# EAGLE design GPIO_duplication_board (EAGLE 7.3.0)
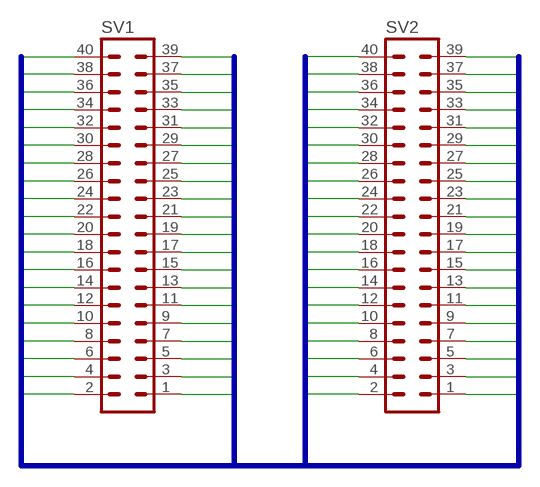
[diagram p0: schematic, sheet 1]

## Parts
SV1  MA20-2  [MA20-2]
SV2  MA20-2  [MA20-2]

## Nets
B1: SV1.1 SV2.1
B2: SV1.2 SV2.2
B3: SV1.3 SV2.3
B4: SV1.4 SV2.4
B5: SV1.5 SV2.5
B6: SV1.6 SV2.6
B7: SV1.7 SV2.7
B8: SV1.8 SV2.8
B9: SV1.9 SV2.9
B10: SV1.10 SV2.10
B11: SV1.11 SV2.11
B12: SV1.12 SV2.12
B13: SV1.13 SV2.13
B14: SV1.14 SV2.14
B15: SV1.15 SV2.15
B16: SV1.16 SV2.16
B17: SV1.17 SV2.17
B18: SV1.18 SV2.18
B19: SV1.19 SV2.19
B20: SV1.20 SV2.20
B21: SV1.21 SV2.21
B22: SV1.22 SV2.22
B23: SV1.23 SV2.23
B24: SV1.24 SV2.24
B25: SV1.25 SV2.25
B26: SV1.26 SV2.26
B27: SV1.27 SV2.27
B28: SV1.28 SV2.28
B29: SV1.29 SV2.29
B30: SV1.30 SV2.30
B31: SV1.31 SV2.31
B32: SV1.32 SV2.32
B33: SV1.33 SV2.33
B34: SV1.34 SV2.34
B35: SV1.35 SV2.35
B36: SV1.36 SV2.36
B37: SV1.37 SV2.37
B38: SV1.38 SV2.38
B39: SV1.39 SV2.39
B40: SV1.40 SV2.40

## Buses
B[1..40]

## Library data of the parts
SV1 SV2 = con-lstb:MA20-2: PIN HEADER; OC_FARNELL: unknown; OC_NEWARK: unknown

## Board
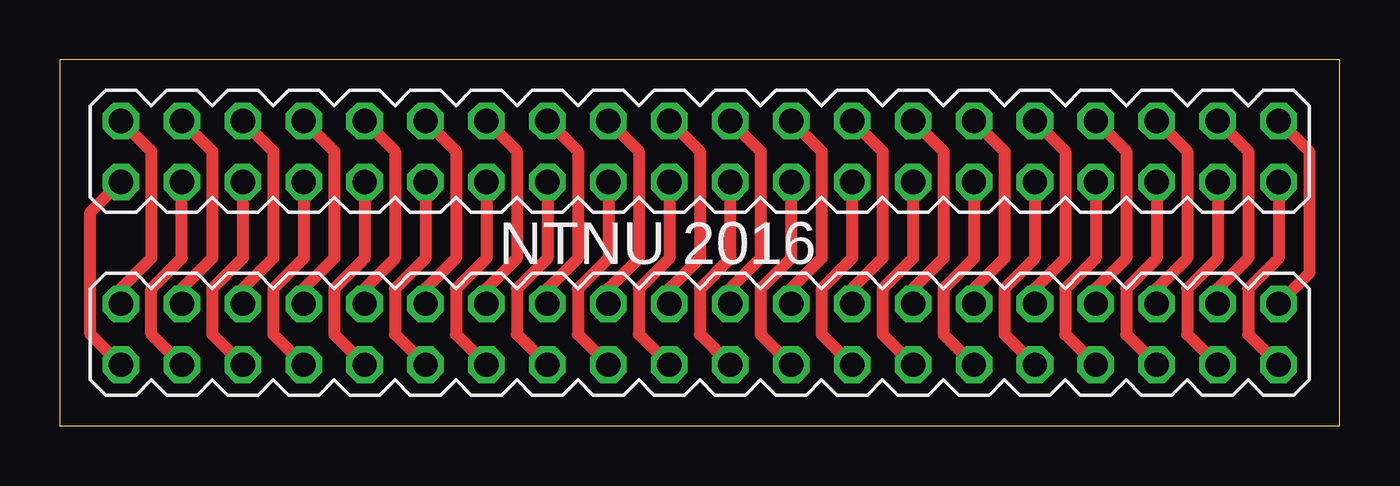
[diagram p1: board, top side]

Size 53.34 x 15.24 mm. Coordinates in mm from the lower left corner, seen from the top.
Outline: 0,0 53.34,0 53.34,15.24 0,15.24 0,0
Copper layers (1*16): Top 0.035mm / dielectric 1.5mm / Bottom 0.035mm
Design rules "default *": minimum track width 20mil, minimum drill 24mil, track to track 8mil, track to pad 8mil, pad to pad 8mil, via to via 8mil, smd to smd 8mil, copper to edge 40mil, drill to drill 8mil, minimum pad ring 10mil, minimum via ring 8mil, stop-mask expansion 4mil, vias tented up to drill 0mil, thermal gap 10mil

### Footprints (pad centres in the part's own frame; a part is rotated, then mirrored left to right if it is on the bottom)
MA20-2 = drill 1.016 octagon: 1 -24.13,-1.27; 2 -24.13,1.27; 3 -21.59,-1.27; 4 -21.59,1.27; 5 -19.05,-1.27; 6 -19.05,1.27; 7 -16.51,-1.27; 8 -16.51,1.27; 9 -13.97,-1.27; 10 -13.97,1.27; 11 -11.43,-1.27; 12 -11.43,1.27; 13 -8.89,-1.27; 14 -8.89,1.27; 15 -6.35,-1.27; 16 -6.35,1.27; 17 -3.81,-1.27; 18 -3.81,1.27; 19 -1.27,-1.27; 20 -1.27,1.27; 21 1.27,-1.27; 22 1.27,1.27; 23 3.81,-1.27; 24 3.81,1.27; 25 6.35,-1.27; 26 6.35,1.27; 27 8.89,-1.27; 28 8.89,1.27; 29 11.43,-1.27; 30 11.43,1.27; 31 13.97,-1.27; 32 13.97,1.27; 33 16.51,-1.27; 34 16.51,1.27; 35 19.05,-1.27; 36 19.05,1.27; 37 21.59,-1.27; 38 21.59,1.27; 39 24.13,-1.27; 40 24.13,1.27

### Placement (x,y rotation side)
SV1  26.67,3.81 0 top
SV2  26.67,11.43 0 top

### Tracks (layer width: path | path; a pad name or v marks a point on that pad's centre or on a via)
B1
  Top 0.508: SV1.1 1.27,3.81 1.27,8.89 SV2.1
B2
  Top 0.508: SV1.2 2.54,5.71 3.81,6.99 3.81,11.43 SV2.2
B3
  Top 0.508: SV1.3 3.81,3.81 3.81,5.71 5.08,6.99 SV2.3
B4
  Top 0.508: SV1.4 5.08,5.71 6.35,6.99 6.35,11.43 SV2.4
B5
  Top 0.508: SV1.5 6.35,3.81 6.35,5.71 7.62,6.99 SV2.5
B6
  Top 0.508: SV1.6 7.62,5.71 8.89,6.99 8.89,11.43 SV2.6
B7
  Top 0.508: SV1.7 8.89,3.81 8.89,5.71 10.16,6.99 SV2.7
B8
  Top 0.508: SV1.8 10.16,5.71 11.43,6.99 11.43,11.43 SV2.8
B9
  Top 0.508: SV1.9 11.43,3.81 11.43,5.71 12.7,6.99 SV2.9
B10
  Top 0.508: SV1.10 12.7,5.71 13.97,6.99 13.97,11.43 SV2.10
B11
  Top 0.508: SV1.11 13.97,3.81 13.97,5.71 15.24,6.99 SV2.11
B12
  Top 0.508: SV1.12 15.24,5.71 16.51,6.99 16.51,11.43 SV2.12
B13
  Top 0.508: SV1.13 16.51,3.81 16.51,5.71 17.78,6.99 SV2.13
B14
  Top 0.508: SV1.14 17.78,5.71 19.05,6.99 19.05,11.43 SV2.14
B15
  Top 0.508: SV1.15 19.05,3.81 19.05,5.71 20.32,6.99 SV2.15
B16
  Top 0.508: SV1.16 20.32,5.71 21.59,6.99 21.59,11.43 SV2.16
B17
  Top 0.508: SV1.17 21.59,3.81 21.59,5.71 22.86,6.99 SV2.17
B18
  Top 0.508: SV1.18 22.86,5.71 24.13,6.99 24.13,11.43 SV2.18
B19
  Top 0.508: SV1.19 24.13,3.81 24.13,5.71 25.4,6.99 SV2.19
B20
  Top 0.508: SV1.20 25.4,5.71 26.67,6.99 26.67,11.43 SV2.20
B21
  Top 0.508: SV1.21 26.67,3.81 26.67,5.71 27.94,6.99 SV2.21
B22
  Top 0.508: SV1.22 27.94,5.71 29.21,6.99 29.21,11.43 SV2.22
B23
  Top 0.508: SV1.23 29.21,3.81 29.21,5.71 30.48,6.99 SV2.23
B24
  Top 0.508: SV1.24 30.48,5.71 31.75,6.99 31.75,11.43 SV2.24
B25
  Top 0.508: SV1.25 31.75,3.81 31.75,5.71 33.02,6.99 SV2.25
B26
  Top 0.508: SV1.26 33.02,5.71 34.29,6.99 34.29,11.43 SV2.26
B27
  Top 0.508: SV1.27 34.29,3.81 34.29,5.71 35.56,6.99 SV2.27
B28
  Top 0.508: SV1.28 35.56,5.71 36.83,6.99 36.83,11.43 SV2.28
B29
  Top 0.508: SV1.29 36.83,3.81 36.83,5.71 38.1,6.99 SV2.29
B30
  Top 0.508: SV1.30 38.1,5.71 39.37,6.99 39.37,11.43 SV2.30
B31
  Top 0.508: SV1.31 39.37,3.81 39.37,5.71 40.64,6.99 SV2.31
B32
  Top 0.508: SV1.32 40.64,5.71 41.91,6.99 41.91,11.43 SV2.32
B33
  Top 0.508: SV1.33 41.91,3.81 41.91,5.71 43.18,6.99 SV2.33
B34
  Top 0.508: SV1.34 43.18,5.71 44.45,6.99 44.45,11.43 SV2.34
B35
  Top 0.508: SV1.35 44.45,3.81 44.45,5.71 45.72,6.99 SV2.35
B36
  Top 0.508: SV1.36 45.72,5.71 46.99,6.99 46.99,11.43 SV2.36
B37
  Top 0.508: SV1.37 46.99,3.81 46.99,5.71 48.26,6.99 SV2.37
B38
  Top 0.508: SV1.38 48.26,5.71 49.53,6.99 49.53,11.43 SV2.38
B39
  Top 0.508: SV1.39 49.53,3.81 49.53,5.71 50.8,6.99 SV2.39
B40
  Top 0.508: SV1.40 52.07,6.35 52.07,11.43 SV2.40

### Text on the board
tNames: NTNU 2016